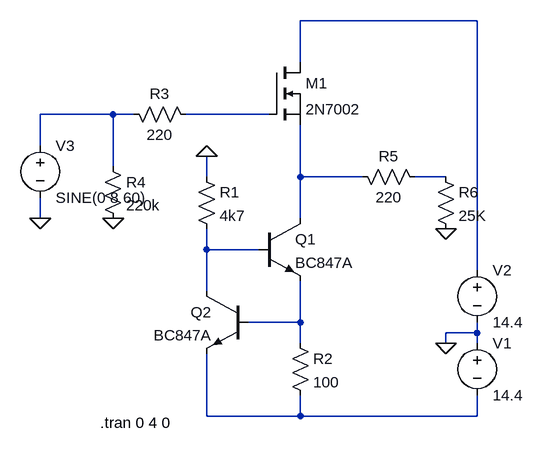
[diagram p0: schematic Follower.asc]
Follower.asc, the LTspice schematic file:
Version 4
SHEET 1 880 680
WIRE 544 -128 272 -128
WIRE 272 -64 272 -128
WIRE -16 16 -128 16
WIRE 16 16 -16 16
WIRE 224 16 96 16
WIRE -128 64 -128 16
WIRE -16 96 -16 16
WIRE 128 112 128 80
WIRE 272 112 272 32
WIRE 368 112 272 112
WIRE 496 112 448 112
WIRE -128 176 -128 144
WIRE 272 176 272 112
WIRE 128 224 128 192
WIRE 208 224 128 224
WIRE 544 256 544 -128
WIRE 128 288 128 224
WIRE 272 336 272 272
WIRE 272 336 192 336
WIRE 544 352 544 336
WIRE 544 352 496 352
WIRE 272 368 272 336
WIRE 496 368 496 352
WIRE 544 368 544 352
WIRE 128 480 128 384
WIRE 272 480 272 448
WIRE 272 480 128 480
WIRE 544 480 544 448
WIRE 544 480 272 480
FLAG 128 80 0
FLAG 496 368 0
FLAG -16 176 0
FLAG -128 176 0
FLAG 496 192 0
SYMBOL npn 208 176 R0
SYMATTR InstName Q1
SYMATTR Value BC847A
SYMBOL npn 192 288 M0
SYMATTR InstName Q2
SYMATTR Value BC847A
SYMBOL res 112 96 R0
SYMATTR InstName R1
SYMATTR Value 4k7
SYMBOL res 256 352 R0
SYMATTR InstName R2
SYMATTR Value 100
SYMBOL voltage 544 352 R0
WINDOW 123 0 0 Left 2
WINDOW 39 0 0 Left 2
SYMATTR InstName V1
SYMATTR Value 14.4
SYMBOL voltage 544 240 R0
WINDOW 123 0 0 Left 2
WINDOW 39 0 0 Left 2
SYMATTR InstName V2
SYMATTR Value 14.4
SYMBOL nmos 224 -64 R0
SYMATTR InstName M1
SYMATTR Value 2N7002
SYMBOL res 112 32 M270
WINDOW 0 32 56 VTop 2
WINDOW 3 0 56 VBottom 2
SYMATTR InstName R3
SYMATTR Value 220
SYMBOL res -32 80 R0
SYMATTR InstName R4
SYMATTR Value 220k
SYMBOL res 464 128 M270
WINDOW 0 32 56 VTop 2
WINDOW 3 0 56 VBottom 2
SYMATTR InstName R5
SYMATTR Value 220
SYMBOL voltage -128 48 R0
WINDOW 123 0 0 Left 2
WINDOW 39 0 0 Left 2
SYMATTR InstName V3
SYMATTR Value SINE(0 8 60)
SYMBOL res 480 96 R0
SYMATTR InstName R6
SYMATTR Value 25K
TEXT -36 490 Left 2 !.tran 0 4 0

The netlist it stands for:
* Follower.asc
Q1 N004 N006 N007 0 BC847A
Q2 N006 N007 N008 0 BC847A
R1 0 N006 4k7
R2 N007 N008 100
V1 0 N008 14.4
V2 N001 0 14.4
M1 N001 N003 N004 N004 2N7002
R3 N003 N002 220
R4 N002 0 220k
R5 N005 N004 220
V3 N002 0 SINE(0 8 60)
R6 N005 0 25K
.model NPN NPN
.model PNP PNP
.lib standard.bjt
.model NMOS NMOS
.model PMOS PMOS
.lib standard.mos
.tran 0 4 0
.backanno
.end